# Altium schematic sheet AC-DC_Box_AssemblyInstructions_277V.SchDoc
size Tabloid; DocumentNumber: 1; SheetNumber: 1; SheetTotal: 11; Pagesize: Tabloide
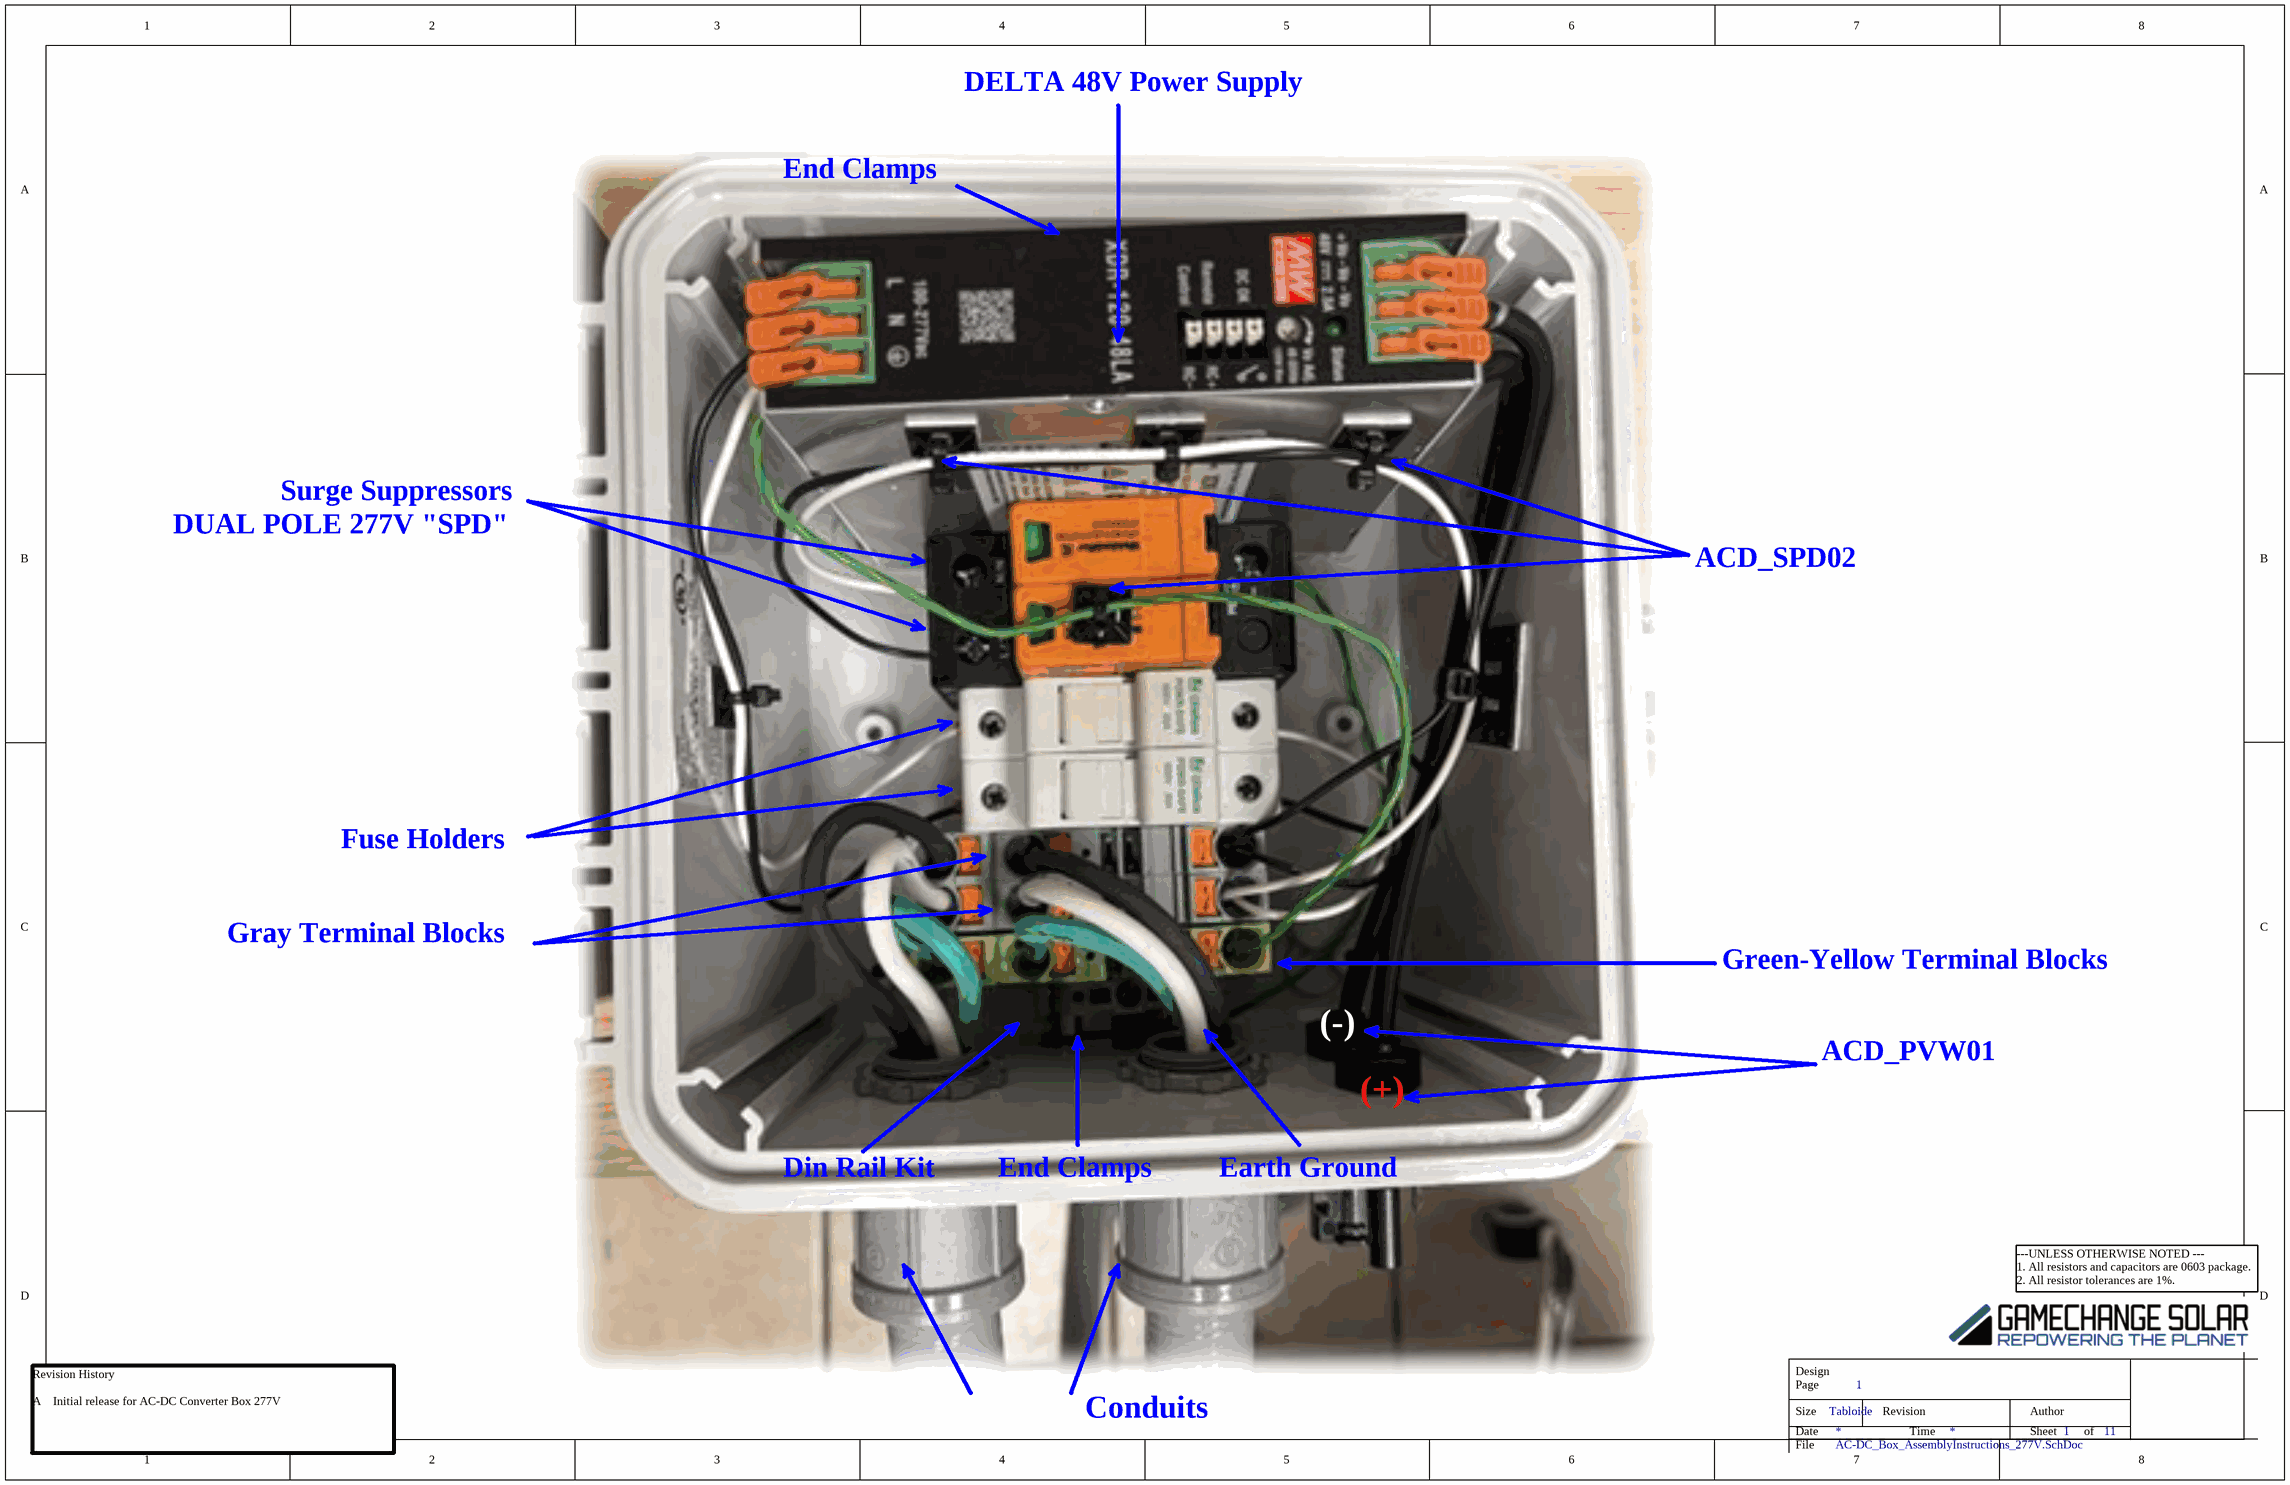
[diagram p0: AC-DC_Box_AssemblyInstructions_277V.SchDoc]

## Notes on the sheet
- DELTA 48V Power Supply
- End Clamps
- DUAL POLE 277V "SPD"
- Surge Suppressors
- ACD_SPD02
- Fuse Holders
- Gray Terminal Blocks
- Green-Yellow Terminal Blocks
- (-)
- (+)
- ACD_PVW01
- Din Rail Kit
- Earth Ground
- Conduits
- Revision History
  A    Initial release for AC-DC Converter Box 277V
- ---UNLESS OTHERWISE NOTED ---
  1. All resistors and capacitors are 0603 package.
  2. All resistor tolerances are 1%.
- Design
- Size
- Date
- Page
- Revision
- Time
- Sheet
- Author
- of
- File